# Altium schematic sheet USB-UART.SchDoc: USB-UART
size A4; Author: João Guimarães; Organization: Altium Limited; Address1: L3, 12a Rodborough Rd; Address2: Frenchs Forest; Address3: NSW; Address4: Australia 2086; SheetNumber: 2; SheetTotal: 7; Version: 1.0.0; PCB: MainBoard; Project: Automotive Network EVB
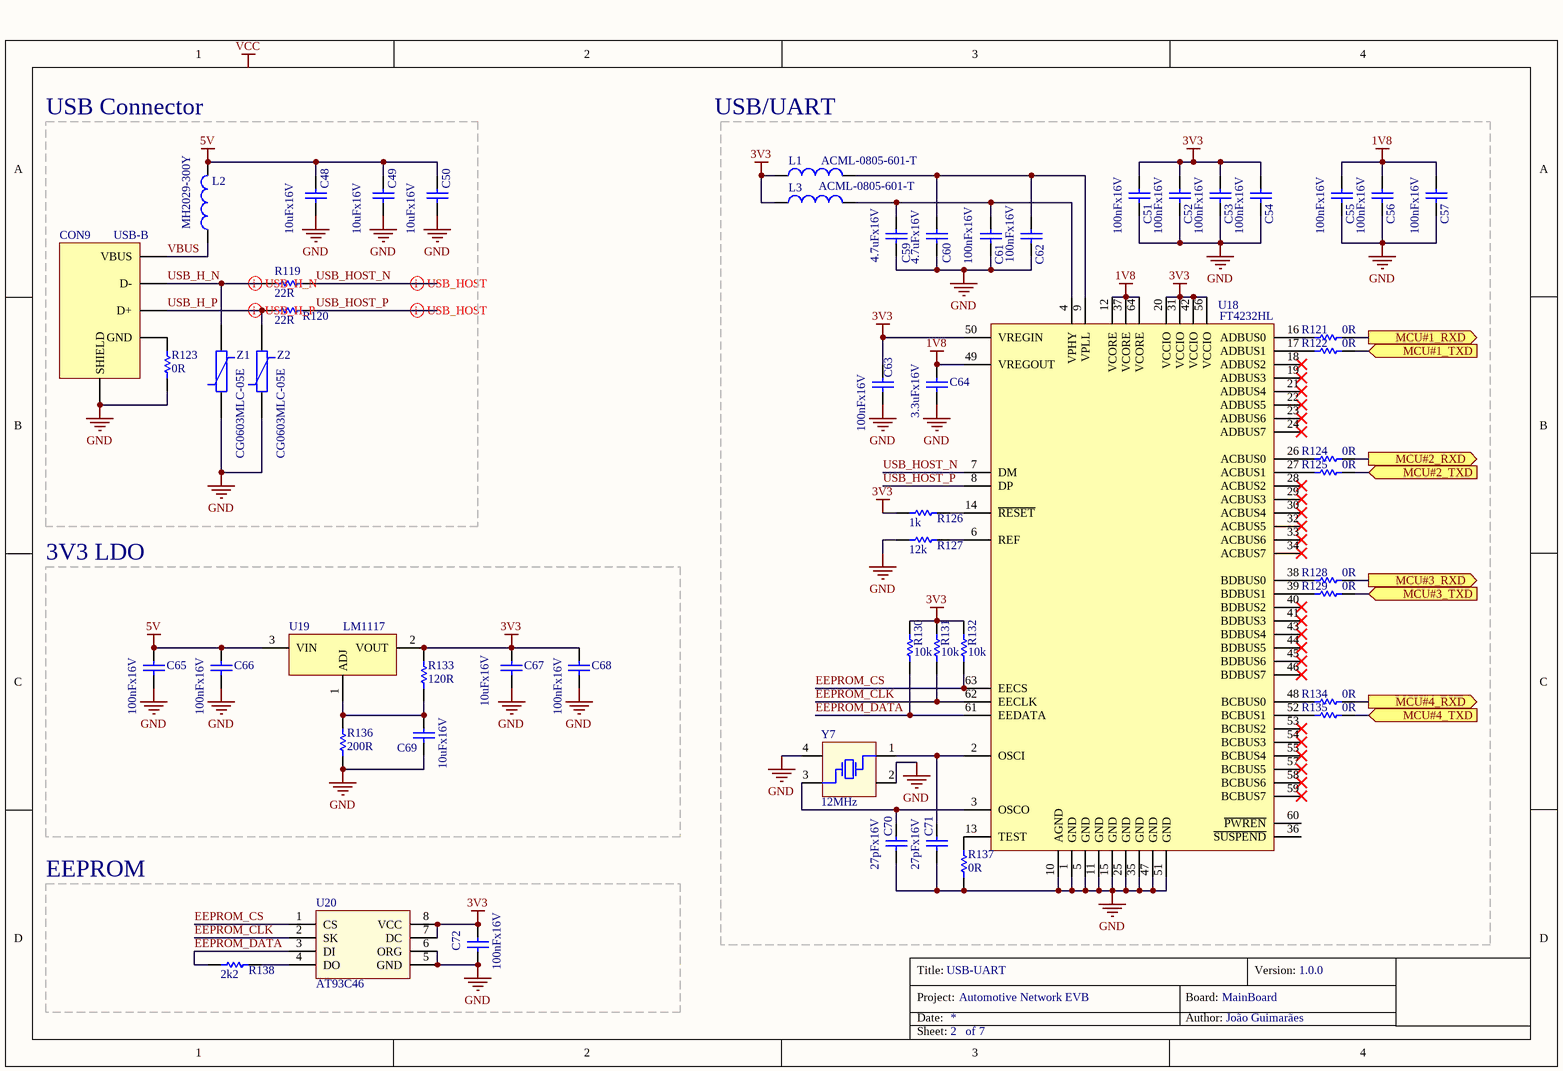
[diagram p0: USB-UART.SchDoc]

## Parts
C48  10uFx16V  [DISC-0805]
C49  10uFx16V  [DISC-0805]
C50  10uFx16V  [DISC-0805]
C51  100nFx16V  [DISC-0603]
C52  100nFx16V  [DISC-0603]
C53  100nFx16V  [DISC-0603]
C54  100nFx16V  [DISC-0603]
C55  100nFx16V  [DISC-0603]
C56  100nFx16V  [DISC-0603]
C57  100nFx16V  [DISC-0603]
C59  4.7uFx16V  [DISC-0805]
C60  4.7uFx16V  [DISC-0805]
C61  100nFx16V  [DISC-0603]
C62  100nFx16V  [DISC-0603]
C63  100nFx16V  [DISC-0603]
C64  3.3uFx16V  [DISC-0603]
C65  100nFx16V  [DISC-0603]
C66  100nFx16V  [DISC-0603]
C67  10uFx16V  [DISC-0805]
C68  100nFx16V  [DISC-0603]
C69  10uFx16V  [DISC-0805]
C70  27pFx16V  [DISC-0603]
C71  27pFx16V  [DISC-0603]
C72  100nFx16V  [DISC-0603]
CON9  USB-B  [CON-USB-B]
L1  ACML-0805-601-T  [DISC-0805]
L2  MH2029-300Y  [DISC-0805]
L3  ACML-0805-601-T  [DISC-0805]
R119  22R  [DISC-0603]
R120  22R  [DISC-0603]
R121  0R  [DISC-0603]
R122  0R  [DISC-0603]
R123  0R  [DISC-0603]
R124  0R  [DISC-0603]
R125  0R  [DISC-0603]
R126  1k  [DISC-0603]
R127  12k  [DISC-0603]
R128  0R  [DISC-0603]
R129  0R  [DISC-0603]
R130  10k  [DISC-0603]
R131  10k  [DISC-0603]
R132  10k  [DISC-0603]
R133  120R  [DISC-0603]
R134  0R  [DISC-0603]
R135  0R  [DISC-0603]
R136  200R  [DISC-0603]
R137  0R  [DISC-0603]
R138  2k2  [DISC-0603]
U18  FT4232HL  [CI-LQFP-64]
U19  LM1117  [DISC-SOT-223]
U20  AT93C46  [CI-SOIC-8]
Y7  12MHz  [DISC-CRYSTAL-4P-7X5]
Z1  CG0603MLC-05E  [DISC-0603]
Z2  CG0603MLC-05E  [DISC-0603]

## Blocks framed on the sheet
USB Connector: C48-C50 CON9 L2 R119 R120 R123 Z1 Z2
3V3 LDO: C65-C69 R133 R136 U19
EEPROM: C72 R138 U20

## Ports
MCU#1_RXD (out), MCU#1_TXD (in), MCU#2_RXD (out), MCU#2_TXD (in), MCU#3_RXD (out), MCU#3_TXD (in), MCU#4_RXD (out), MCU#4_TXD (in)

## Nets
1V8: C55.1 C56.1 C57.1 C64.1 U18.12(VCORE) U18.37(VCORE) U18.49(VREGOUT) U18.64(VCORE)
3V3: C51.1 C52.1 C53.1 C54.1 C63.1 C67.1 C68.1 C72.1 L1.1 L3.1 R126.1 R130.2 R131.2 R132.2 R133.2 U18.20(VCCIO) U18.31(VCCIO) U18.42(VCCIO) U18.50(VREGIN) U18.56(VCCIO) U19.2(VOUT) U19.4(VOUT) U20.7(DC) U20.8(VCC)
5V: C48.1 C49.1 C50.1 C65.1 C66.1 L2.2 U19.3(VIN)
GND: C48.2 C49.2 C50.2 C51.2 C52.2 C53.2 C54.2 C55.2 C56.2 C57.2 C59.2 C60.2 C61.2 C62.2 C63.2 C64.2 C65.2 C66.2 C67.2 C68.2 C69.2 C70.1 C71.1 C72.2 CON9.5(SHIELD) CON9.6(SHIELD) R123.1 R127.1 R136.1 R137.1 U18.1(GND) U18.5(GND) U18.10(AGND) U18.11(GND) U18.15(GND) U18.25(GND) U18.35(GND) U18.47(GND) U18.51(GND) U20.5(GND) U20.6(ORG) Y7.2(GND) Y7.4(GND) Z1.1 Z2.1
EEPROM_CLK: R131.1 U18.62(EECLK) U20.2(SK)
EEPROM_CS: R132.1 U18.63(EECS) U20.1(CS)
EEPROM_DATA: R130.1 R138.1 U18.61(EEDATA) U20.3(DI)
MCU#1_RXD: R121.2 ; port MCU#1_RXD
MCU#1_TXD: R122.2 ; port MCU#1_TXD
MCU#2_RXD: R124.2 ; port MCU#2_RXD
MCU#2_TXD: R125.2 ; port MCU#2_TXD
MCU#3_RXD: R128.2 ; port MCU#3_RXD
MCU#3_TXD: R129.2 ; port MCU#3_TXD
MCU#4_RXD: R134.2 ; port MCU#4_RXD
MCU#4_TXD: R135.2 ; port MCU#4_TXD
USB_H_N: CON9.2(D-) R119.1 Z1.2
USB_H_P: CON9.3(D+) R120.1 Z2.2
USB_HOST_N: R119.2 U18.7(DM)
USB_HOST_P: R120.2 U18.8(DP)
VBUS: CON9.1(VBUS) L2.1
NetC59_1: C59.1 C61.1 L3.2 U18.4(VPHY)
NetC60_1: C60.1 C62.1 L1.2 U18.9(VPLL)
NetC69_1: C69.1 R133.1 R136.2 U19.1(ADJ)
NetC70_2: C70.2 U18.3(OSCO) Y7.3(OSC2)
NetC71_2: C71.2 U18.2(OSCI) Y7.1(OSC1)
NetCON9_4: CON9.4(GND) R123.2
NetR121_1: R121.1 U18.16(ADBUS0)
NetR122_1: R122.1 U18.17(ADBUS1)
NetR124_1: R124.1 U18.26(ACBUS0)
NetR125_1: R125.1 U18.27(ACBUS1)
NetR126_2: R126.2 U18.14(~{RESET})
NetR127_2: R127.2 U18.6(REF)
NetR128_1: R128.1 U18.38(BDBUS0)
NetR129_1: R129.1 U18.39(BDBUS1)
NetR134_1: R134.1 U18.48(BCBUS0)
NetR135_1: R135.1 U18.52(BCBUS1)
NetR137_2: R137.2 U18.13(TEST)
NetR138_2: R138.2 U20.4(DO)

Not connected (* = marked no-connect by the designer): U18 18(ADBUS2)* 19(ADBUS3)* 21(ADBUS4)* 22(ADBUS5)* 23(ADBUS6)* 24(ADBUS7)* 28(ACBUS2)* 29(ACBUS3)* 30(ACBUS4)* 32(ACBUS5)* 33(ACBUS6)* 34(ACBUS7)* 36(~{SUSPEND}) 40(BDBUS2)* 41(BDBUS3)* 43(BDBUS4)* 44(BDBUS5)* 45(BDBUS6)* 46(BDBUS7)* 53(BCBUS2)* 54(BCBUS3)* 55(BCBUS4)* 57(BCBUS5)* 58(BCBUS6)* 59(BCBUS7)* 60(~{PWREN})

## Layout directives
differential pair; net class USBDIF: USB_H_N, USB_H_P, USB_HOST_N, USB_HOST_P

## Notes on the sheet
- USB/UART
- Labels drawn without touching a wire or pin: VCC
- Title:
- Project:
- Date:
- Author:
- Board:
- Version:
- Sheet:
- of

## Library data of the parts
C48-C50 C67 C69 = Cap: Capacitor; PartNumber1: EMK212ABJ106MG-T; Manufacturer1: TaiyoYuden; ClassName: UsbUart
C51-C57 C61-C63 C65 C66 C68 C72 = Cap: Capacitor; PartNumber1: C0603C104Z3VACTU; Manufacturer1: Kemet; ClassName: UsbUart
C59 C60 = Cap: Capacitor; PartNumber1: 0805X475M250CT; Manufacturer1: Walsin; ClassName: UsbUart
C64 = Cap: Capacitor; PartNumber1: C1608X5R1C335K080AC; Manufacturer1: TDK; ClassName: UsbUart
C70 C71 = Cap: Capacitor; PartNumber1: C0805C270J3HACTU; Manufacturer1: Kemet; ClassName: UsbUart
CON9 = USB Type-B: PartNumber1: UJ2-BH-1-TH; Manufacturer1: CUI; ClassName: UsbUart
L1 L3 = Inductor: Chip Inductor; Manufacturer1: Abracon; ClassName: UsbUart; PartNumber1: ACML-0805-601-T
L2 = Inductor: Chip Inductor; Manufacturer1: Bourns; ClassName: UsbUart; PartNumber1: MH2029-300Y
R119 R120 = Res: Resistor; PartNumber1: RC0603FR-0722RL; Manufacturer1: Yageo; ClassName: UsbUart
R121-R125 R128 R129 R134 R135 R137 = Res: Resistor; PartNumber1: RC0603JR-070RL; Manufacturer1: Yageo; ClassName: UsbUart
R126 = Res: Resistor; PartNumber1: RC0603FR-071KL; Manufacturer1: Yageo; ClassName: UsbUart
R127 = Res: Resistor; PartNumber1: RC0603FR-0712KL; Manufacturer1: Yageo; ClassName: UsbUart
R130-R132 = Res: Resistor; PartNumber1: RC0603FR-0710KL; Manufacturer1: Yageo; ClassName: UsbUart
R133 = Res: Resistor; PartNumber1: RC0603FR-07120RL; Manufacturer1: Yageo; ClassName: UsbUart
R136 = Res: Resistor; PartNumber1: RC0603FR-07200RL; Manufacturer1: Yageo; ClassName: UsbUart
R138 = Res: Resistor; PartNumber1: RC0603FR-072K2L; Manufacturer1: Yageo; ClassName: UsbUart
U18 = FT4232HL: Quad High Speed USB to Multipurpose UART/MPSSE; Manufacturer1: FTDI; ClassName: UsbUart; PartNumber1: FT4232HL
U19 = LM317-N: Wide Temperature Three-Pin Adjustable Regulator; PartNumber1: LM1117-N; Manufacturer1: Texas Instruments; ClassName: UsbUart
U20 = AT93C46: 3-wire Serial EEPROMs; PartNumber1: AT93C46DN-SH-T; Manufacturer1: Microchip; ClassName: UsbUart
Y7 = XTAL-4-PIN: ABMM-12.000MHZ-B2-T; Manufacturer1: Abracon; ClassName: UsbUart; PartNumber1: ABMM-12.000MHZ-B2-T
Z1 Z2 = Varistor: Manufacturer1: Bourns; ClassName: UsbUart; PartNumber1: CG0603MLC-05E